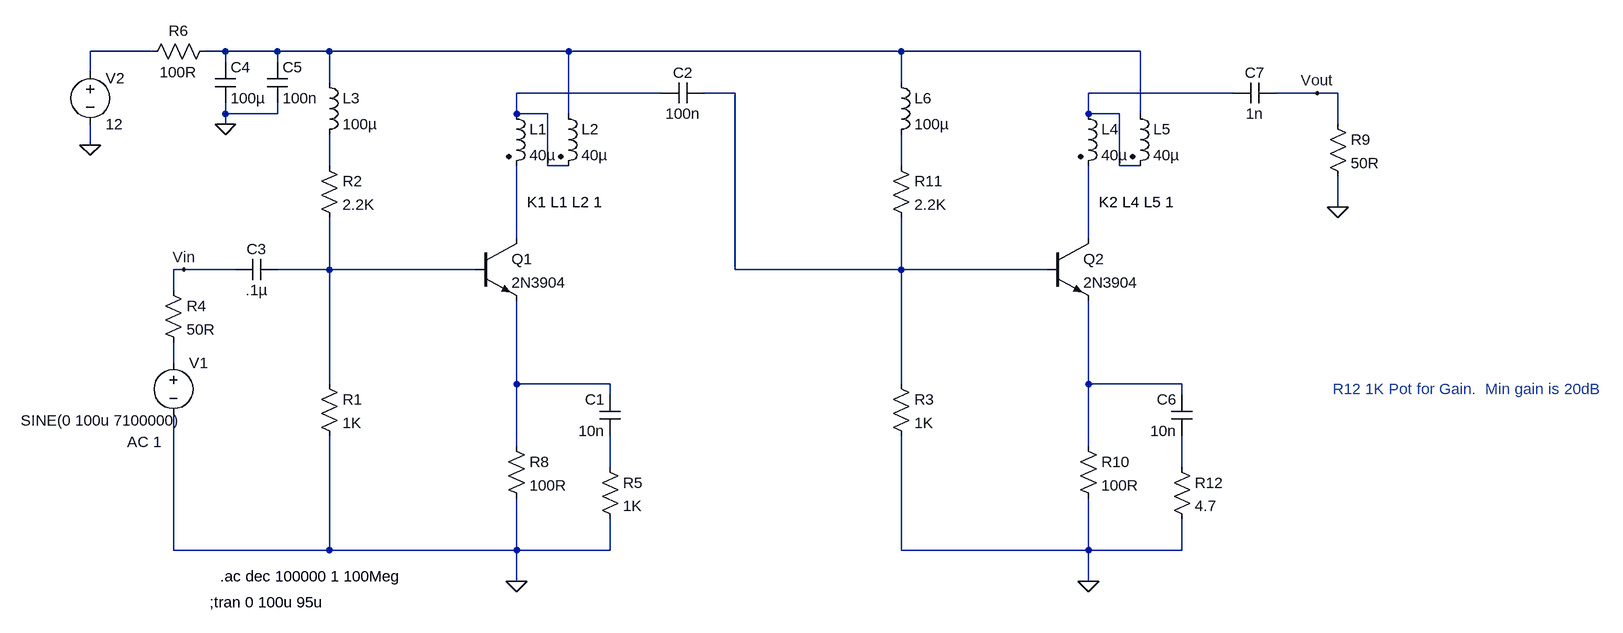
[diagram p0: schematic N6QW 2N2222 Preamps Testing.asc]
N6QW 2N2222 Preamps Testing.asc, the LTspice schematic file:
Version 4
SHEET 1 2072 816
WIRE -240 -176 -336 -176
WIRE -128 -176 -160 -176
WIRE -48 -176 -128 -176
WIRE 32 -176 -48 -176
WIRE 400 -176 32 -176
WIRE 912 -176 400 -176
WIRE 1280 -176 912 -176
WIRE -128 -160 -128 -176
WIRE -48 -160 -48 -176
WIRE -336 -144 -336 -176
WIRE 32 -128 32 -176
WIRE 912 -128 912 -176
WIRE 544 -112 320 -112
WIRE 656 -112 608 -112
WIRE 1424 -112 1200 -112
WIRE 1552 -112 1488 -112
WIRE 1584 -112 1552 -112
WIRE -128 -80 -128 -96
WIRE -48 -80 -48 -96
WIRE -48 -80 -128 -80
WIRE 320 -80 320 -112
WIRE 368 -80 320 -80
WIRE 400 -80 400 -176
WIRE 1200 -80 1200 -112
WIRE 1248 -80 1200 -80
WIRE 1280 -80 1280 -176
WIRE -128 -64 -128 -80
WIRE 1584 -64 1584 -112
WIRE -336 -32 -336 -64
WIRE 32 0 32 -48
WIRE 368 0 368 -80
WIRE 400 0 368 0
WIRE 912 0 912 -48
WIRE 1248 0 1248 -80
WIRE 1280 0 1248 0
WIRE 1584 64 1584 16
WIRE 320 112 320 0
WIRE 1200 112 1200 0
WIRE -192 160 -208 160
WIRE -112 160 -192 160
WIRE 32 160 32 80
WIRE 32 160 -48 160
WIRE 256 160 32 160
WIRE 656 160 656 -112
WIRE 912 160 912 80
WIRE 912 160 656 160
WIRE 1136 160 912 160
WIRE -208 192 -208 160
WIRE -208 304 -208 272
WIRE 32 336 32 160
WIRE 320 336 320 208
WIRE 464 336 320 336
WIRE 912 336 912 160
WIRE 1200 336 1200 208
WIRE 1344 336 1200 336
WIRE 464 352 464 336
WIRE 1344 352 1344 336
WIRE 320 432 320 336
WIRE 1200 432 1200 336
WIRE 464 464 464 416
WIRE 1344 464 1344 416
WIRE -208 592 -208 384
WIRE 32 592 32 416
WIRE 32 592 -208 592
WIRE 320 592 320 512
WIRE 320 592 32 592
WIRE 464 592 464 544
WIRE 464 592 320 592
WIRE 912 592 912 416
WIRE 1200 592 1200 512
WIRE 1200 592 912 592
WIRE 1344 592 1344 544
WIRE 1344 592 1200 592
WIRE 320 640 320 592
WIRE 1200 640 1200 592
FLAG -336 -32 0
FLAG 320 640 0
FLAG -192 160 Vin
FLAG -128 -64 0
FLAG 1200 640 0
FLAG 1584 64 0
FLAG 1552 -112 Vout
SYMBOL npn 256 112 R0
SYMATTR InstName Q1
SYMATTR Value 2N3904
SYMBOL voltage -208 288 R0
WINDOW 123 -71 137 Left 2
WINDOW 39 -107 169 Left 2
WINDOW 3 -235 104 Left 2
SYMATTR Value2 AC 1
SYMATTR Value SINE(0 100u 7100000)
SYMATTR InstName V1
SYMBOL res 16 320 R0
SYMATTR InstName R1
SYMATTR Value 1K
SYMBOL cap 480 416 R180
WINDOW 0 24 56 Left 2
WINDOW 3 24 8 Left 2
SYMATTR InstName C1
SYMATTR Value 10n
SYMBOL cap -48 144 R90
WINDOW 0 0 32 VBottom 2
WINDOW 3 32 32 VTop 2
SYMATTR InstName C3
SYMATTR Value .1µ
SYMBOL res -144 -192 R90
WINDOW 0 0 56 VBottom 2
WINDOW 3 32 56 VTop 2
SYMATTR InstName R6
SYMATTR Value 100R
SYMBOL voltage -336 -160 R0
WINDOW 0 24 25 Left 2
WINDOW 123 0 0 Left 2
WINDOW 39 0 0 Left 2
SYMATTR InstName V2
SYMATTR Value 12
SYMBOL ind2 304 -96 R0
SYMATTR InstName L1
SYMATTR Value 40µ
SYMATTR Type ind
SYMBOL ind2 384 -96 R0
SYMATTR InstName L2
SYMATTR Value 40µ
SYMATTR Type ind
SYMBOL res 304 416 R0
SYMATTR InstName R8
SYMATTR Value 100R
SYMBOL res -224 176 R0
SYMATTR InstName R4
SYMATTR Value 50R
SYMBOL cap -144 -160 R0
SYMATTR InstName C4
SYMATTR Value 100µ
SYMBOL res 16 -16 R0
SYMATTR InstName R2
SYMATTR Value 2.2K
SYMBOL cap -64 -160 R0
SYMATTR InstName C5
SYMATTR Value 100n
SYMBOL ind 16 -144 R0
SYMATTR InstName L3
SYMATTR Value 100µ
SYMBOL res 448 448 R0
SYMATTR InstName R5
SYMATTR Value 1K
SYMBOL npn 1136 112 R0
SYMATTR InstName Q2
SYMATTR Value 2N3904
SYMBOL res 896 320 R0
SYMATTR InstName R3
SYMATTR Value 1K
SYMBOL cap 1360 416 R180
WINDOW 0 24 56 Left 2
WINDOW 3 24 8 Left 2
SYMATTR InstName C6
SYMATTR Value 10n
SYMBOL cap 1488 -128 R90
WINDOW 0 0 32 VBottom 2
WINDOW 3 32 32 VTop 2
SYMATTR InstName C7
SYMATTR Value 1n
SYMBOL ind2 1184 -96 R0
SYMATTR InstName L4
SYMATTR Value 40µ
SYMATTR Type ind
SYMBOL ind2 1264 -96 R0
SYMATTR InstName L5
SYMATTR Value 40µ
SYMATTR Type ind
SYMBOL res 1568 -80 R0
SYMATTR InstName R9
SYMATTR Value 50R
SYMBOL res 1184 416 R0
SYMATTR InstName R10
SYMATTR Value 100R
SYMBOL res 896 -16 R0
SYMATTR InstName R11
SYMATTR Value 2.2K
SYMBOL ind 896 -144 R0
SYMATTR InstName L6
SYMATTR Value 100µ
SYMBOL res 1328 448 R0
SYMATTR InstName R12
SYMATTR Value 4.7
SYMBOL cap 608 -128 R90
WINDOW 0 0 32 VBottom 2
WINDOW 3 32 32 VTop 2
SYMATTR InstName C2
SYMATTR Value 100n
TEXT 336 56 Left 2 !K1 L1 L2 1
TEXT -136 632 Left 2 !.ac dec 100000 1 100Meg
TEXT -152 672 Left 2 !;tran 0 100u 95u
TEXT 1216 56 Left 2 !K2 L4 L5 1
TEXT 1576 344 Left 2 ;R12 1K Pot for Gain.  Min gain is 20dB

The netlist it stands for:
* N6QW 2N2222 Preamps Testing.asc
Q1 N008 N010 N012 0 2N3904
V1 N011 0 SINE(0 100u 7100000) AC 1
R1 N010 0 1K
C1 N014 N012 10n
C3 N010 Vin .1µ
R6 N002 N001 100R
V2 N001 0 12
L1 N003 N008 40µ
L2 N002 N003 40µ
R8 N012 0 100R
R4 Vin N011 50R
C4 N002 0 100µ
R2 N006 N010 2.2K
C5 N002 0 100n
L3 N002 N006 100µ
R5 N014 0 1K
Q2 N009 N004 N013 0 2N3904
R3 N004 0 1K
C6 N015 N013 10n
C7 Vout N005 1n
L4 N005 N009 40µ
L5 N002 N005 40µ
R9 Vout 0 50R
R10 N013 0 100R
R11 N007 N004 2.2K
L6 N002 N007 100µ
R12 N015 0 4.7
C2 N004 N003 100n
.model NPN NPN
.model PNP PNP
.lib standard.bjt
K1 L1 L2 1
.ac dec 100000 1 100Meg
;tran 0 100u 95u
K2 L4 L5 1
* R12 1K Pot for Gain.  Min gain is 20dB
.backanno
.end